# EAGLE design micromouse (EAGLE 9.6.2)
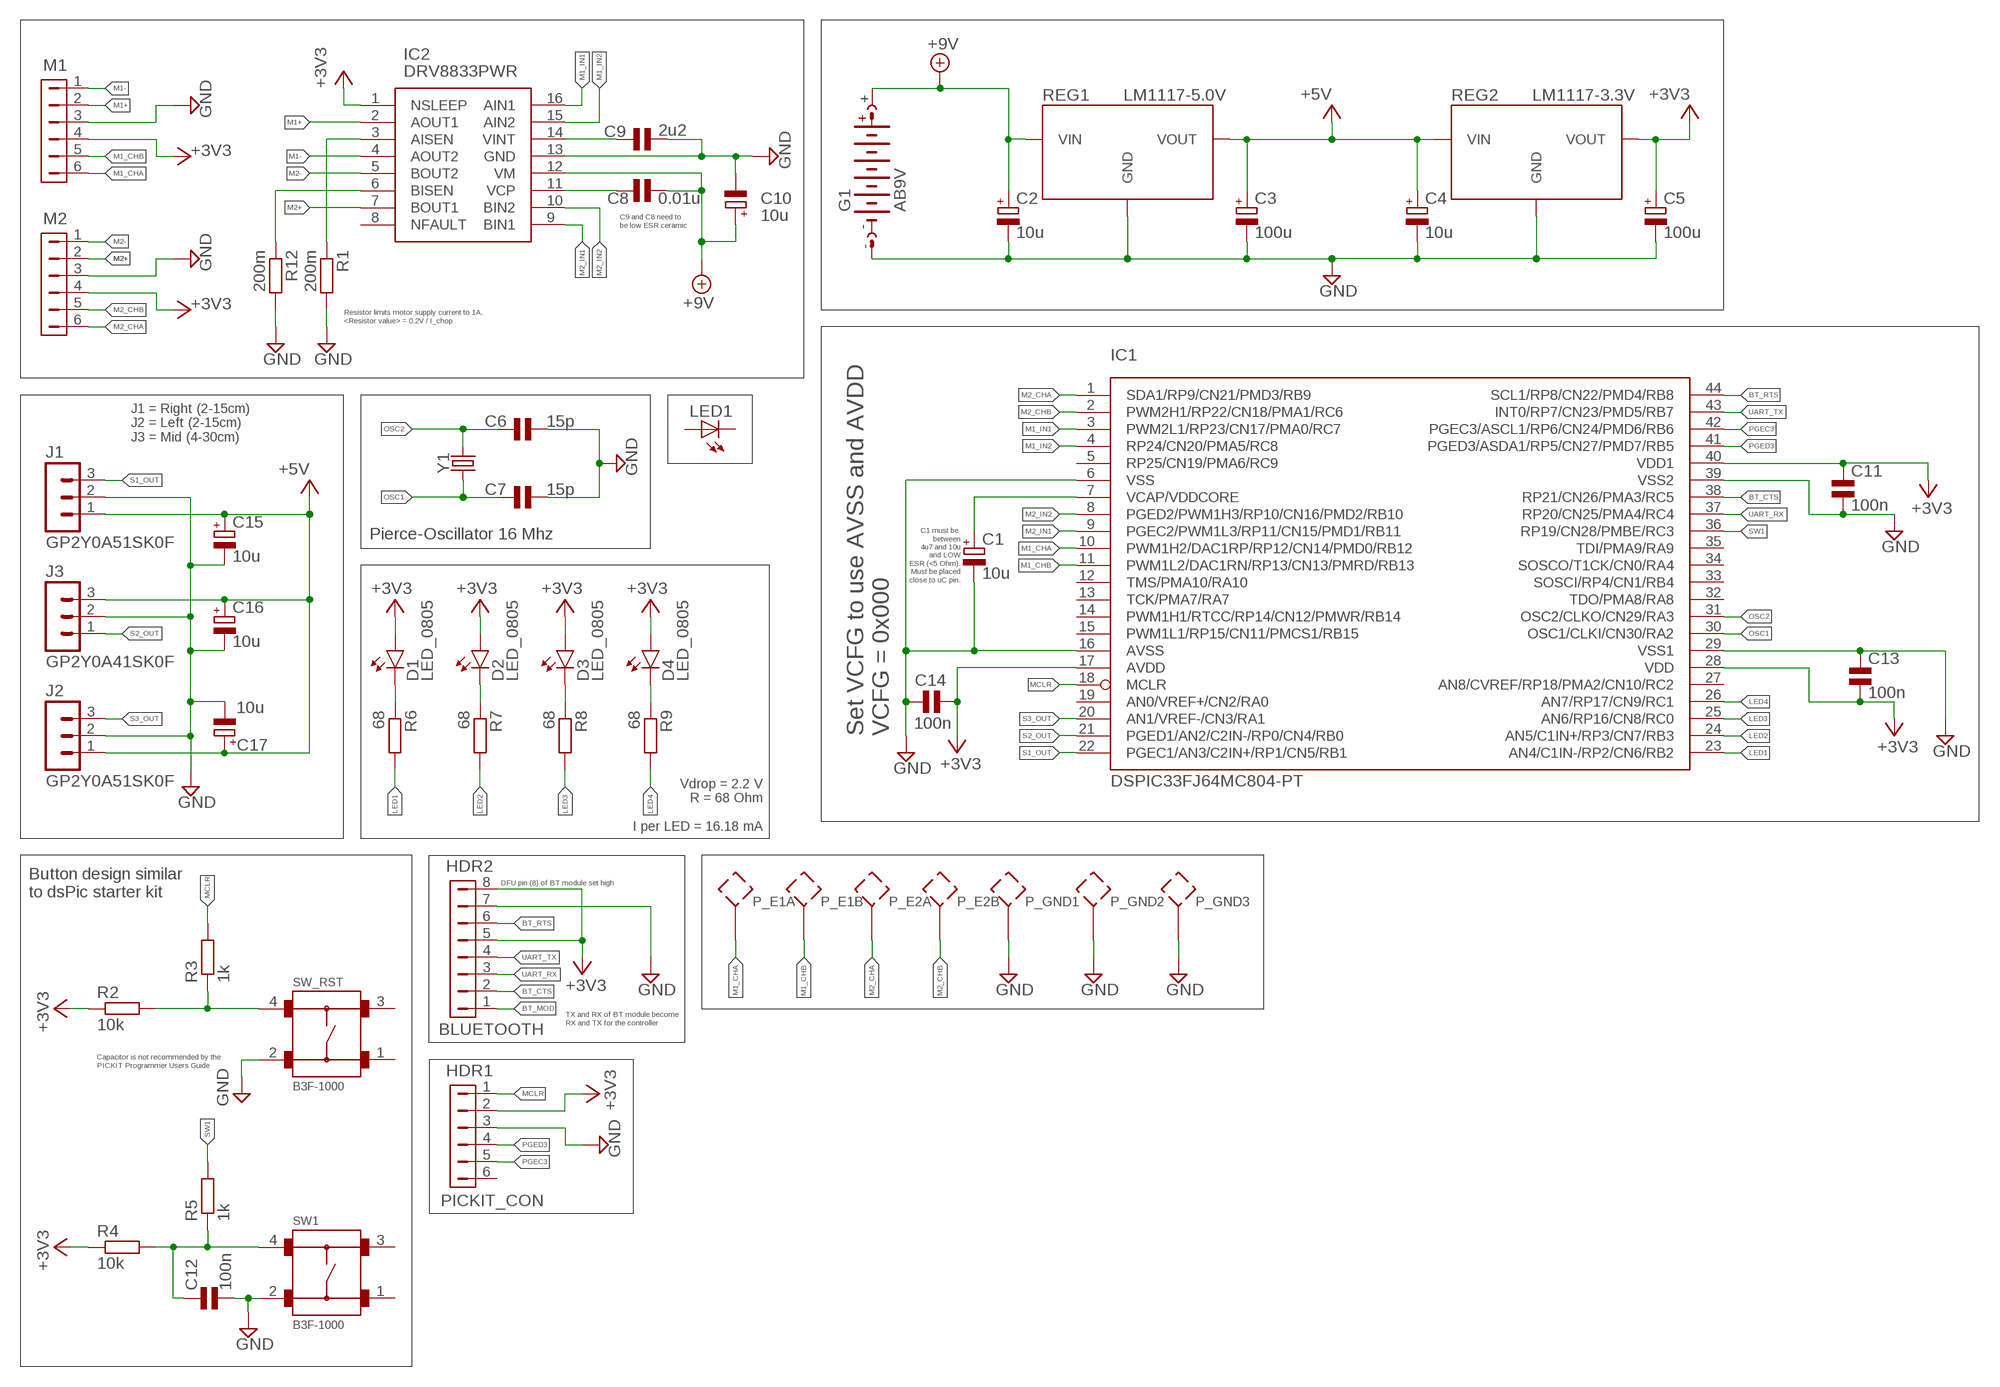
[diagram p0: schematic, sheet 1]

## Parts
C1  10u  CPOL_0805  [0805_POL]
C2  10u  CPOL_0805  [0805_POL]
C3  100u  CPOL_0805  [0805_POL]
C4  10u  CPOL_0805  [0805_POL]
C5  100u  CPOL_0805  [0805_POL]
C6  15p  C_0805  [0805]
C7  15p  C_0805  [0805]
C8  0.01u  C_0805  [0805]
C9  2u2  C_0805  [0805]
C10  10u  CPOL_0805  [0805_POL]
C11  100n  C_0805  [0805]
C12  100n  C_0805  [0805]
C13  100n  C_0805  [0805]
C14  100n  C_0805  [0805]
C15  10u  CPOL_0805  [0805_POL]
C16  10u  CPOL_0805  [0805_POL]
C17  10u  CPOL_0805  [0805_POL]
D1  LED_0805  [SMD_LED_0805]
D2  LED_0805  [SMD_LED_0805]
D3  LED_0805  [SMD_LED_0805]
D4  LED_0805  [SMD_LED_0805]
G1  AB9V  [AB9V]
HDR1  PICKIT_CON  [6PIN]
HDR2  BLUETOOTH  BLUETOOTHSHIELD  [1X08]
IC1  DSPIC33FJ64MC804-PT  [TQFP44]
IC2  DRV8833PWR  [SOP65P640X120-16N]
J1  GP2Y0A51SK0F  B3B-ZR  [B3B-ZR(LF)(SN)]
J2  GP2Y0A51SK0F  B3B-ZR  [B3B-ZR(LF)(SN)]
J3  GP2Y0A41SK0F  B3B-PH-K-S  [B3B-PH-K-S]
LED1  LED5MM  [LED5MM]
M1  MOTOR_CON  [JP3Q]
M2  MOTOR_CON  [JP3Q]
P_E1A  PROBE_POINTTHT  [PROBEPOINT_THT]
P_E1B  PROBE_POINTTHT  [PROBEPOINT_THT]
P_E2A  PROBE_POINTTHT  [PROBEPOINT_THT]
P_E2B  PROBE_POINTTHT  [PROBEPOINT_THT]
P_GND1  PROBE_POINTTHT  [PROBEPOINT_THT]
P_GND2  PROBE_POINTTHT  [PROBEPOINT_THT]
P_GND3  PROBE_POINTTHT  [PROBEPOINT_THT]
R1  200m  R_0805  [0805]
R2  10k  R_0805  [0805]
R3  1k  R_0805  [0805]
R4  10k  R_0805  [0805]
R5  1k  R_0805  [0805]
R6  68  R_0805  [0805]
R7  68  R_0805  [0805]
R8  68  R_0805  [0805]
R9  68  R_0805  [0805]
R12  200m  R_0805  [0805]
REG1  LM1117-5.0V  LM1117_SOT223  [SOT-223-4]
REG2  LM1117-3.3V  LM1117_SOT223  [SOT-223-4]
SW1  B3F-1000  [B3F-1000]
SW_RST  B3F-1000  [B3F-1000]
Y1  CRYSTALPTH-HC49US  [HC49US]

## Nets
+3V3: C5.1(+) C11.1(+) C13.2(-) C14.2(-) D1.P$2(A) D2.P$2(A) D3.P$2(A) D4.P$2(A) HDR1.2 HDR2.5 HDR2.8 IC1.17(AVDD) IC1.28(VDD) IC1.40(VDD1) IC2.1(NSLEEP) M1.4 M2.4 R2.1 R4.1 REG2.2(VOUT) REG2.4(VOUT)
+5V: C3.1(+) C4.1(+) C15.1(+) C16.1(+) C17.1(+) J1.1 J2.1 J3.3 REG1.2(VOUT) REG1.4(VOUT) REG2.3(VIN)
+9V: C2.1(+) C8.1(+) C10.1(+) G1.+ IC2.12(VM) REG1.3(VIN)
BT_CTS: HDR2.2 IC1.38(RP21/CN26/PMA3/RC5)
BT_MOD: HDR2.1
BT_RTS: HDR2.6 IC1.44(SCL1/RP8/CN22/PMD4/RB8)
GND: C1.2(-) C2.2(-) C3.2(-) C4.2(-) C5.2(-) C6.2(-) C7.2(-) C9.2(-) C10.2(-) C11.2(-) C12.2(-) C13.1(+) C14.1(+) C15.2(-) C16.2(-) C17.2(-) G1.- HDR1.3 HDR2.7 IC1.6(VSS) IC1.16(AVSS) IC1.29(VSS1) IC1.39(VSS2) IC2.13(GND) J1.2 J2.2 J3.2 M1.3 M2.3 P_GND1.P$1 P_GND2.P$1 P_GND3.P$1 R1.2 R12.2 REG1.1(GND) REG2.1(GND) SW1.2 SW_RST.2
LED1: IC1.23(AN4/C1IN-/RP2/CN6/RB2) R6.2
LED2: IC1.24(AN5/C1IN+/RP3/CN7/RB3) R7.2
LED3: IC1.25(AN6/RP16/CN8/RC0) R8.2
LED4: IC1.26(AN7/RP17/CN9/RC1) R9.2
M1+: IC2.2(AOUT1) M1.2
M1-: IC2.4(AOUT2) M1.1
M1_CHA: IC1.10(PWM1H2/DAC1RP/RP12/CN14/PMD0/RB12) M1.6 P_E1A.P$1
M1_CHB: IC1.11(PWM1L2/DAC1RN/RP13/CN13/PMRD/RB13) M1.5 P_E1B.P$1
M1_IN1: IC1.3(PWM2L1/RP23/CN17/PMA0/RC7) IC2.16(AIN1)
M1_IN2: IC1.4(RP24/CN20/PMA5/RC8) IC2.15(AIN2)
M2+: IC2.7(BOUT1) M2.2
M2-: IC2.5(BOUT2) M2.1
M2_CHA: IC1.1(SDA1/RP9/CN21/PMD3/RB9) M2.6 P_E2A.P$1
M2_CHB: IC1.2(PWM2H1/RP22/CN18/PMA1/RC6) M2.5 P_E2B.P$1
M2_IN1: IC1.9(PGEC2/PWM1L3/RP11/CN15/PMD1/RB11) IC2.9(BIN1)
M2_IN2: IC1.8(PGED2/PWM1H3/RP10/CN16/PMD2/RB10) IC2.10(BIN2)
MCLR: HDR1.1 IC1.18(MCLR) R3.2
N$1: IC2.6(BISEN) R12.1
N$2: D2.P$1(C) R7.1
N$3: C8.2(-) IC2.11(VCP)
N$4: C9.1(+) IC2.14(VINT)
N$5: IC2.3(AISEN) R1.1
N$6: C12.1(+) R4.2 R5.1 SW1.4
N$7: R2.2 R3.1 SW_RST.4
N$9: D1.P$1(C) R6.1
N$13: D3.P$1(C) R8.1
N$15: D4.P$1(C) R9.1
OSC1: C7.1(+) IC1.30(OSC1/CLKI/CN30/RA2) Y1.1
OSC2: C6.1(+) IC1.31(OSC2/CLKO/CN29/RA3) Y1.2
PGEC3: HDR1.5 IC1.42(PGEC3/ASCL1/RP6/CN24/PMD6/RB6)
PGED3: HDR1.4 IC1.41(PGED3/ASDA1/RP5/CN27/PMD7/RB5)
S1_OUT: IC1.22(PGEC1/AN3/C2IN+/RP1/CN5/RB1) J1.3
S2_OUT: IC1.21(PGED1/AN2/C2IN-/RP0/CN4/RB0) J3.1
S3_OUT: IC1.20(AN1/VREF-/CN3/RA1) J2.3
SW1: IC1.36(RP19/CN28/PMBE/RC3) R5.2
UART_RX: HDR2.3 IC1.37(RP20/CN25/PMA4/RC4)
UART_TX: HDR2.4 IC1.43(INT0/RP7/CN23/PMD5/RB7)
VCAP/VDDCORE: C1.1(+) IC1.7(VCAP/VDDCORE)
Unconnected: HDR1.6 IC1.5(RP25/CN19/PMA6/RC9) IC1.12(TMS/PMA10/RA10) IC1.13(TCK/PMA7/RA7) IC1.14(PWM1H1/RTCC/RP14/CN12/PMWR/RB14) IC1.15(PWM1L1/RP15/CN11/PMCS1/RB15) IC1.19(AN0/VREF+/CN2/RA0) IC1.27(AN8/CVREF/RP18/PMA2/CN10/RC2) IC1.32(TDO/PMA8/RA8) IC1.33(SOSCI/RP4/CN1/RB4) IC1.34(SOSCO/T1CK/CN0/RA4) IC1.35(TDI/PMA9/RA9) IC2.8(NFAULT) LED1.A LED1.K(C) SW1.1 SW1.3 SW_RST.1 SW_RST.3

## Notes on the sheet
- C9 and C8 need to
  be low ESR ceramic
- Resistor limits motor supply current to 1A.
  <Resistor value> = 0.2V / I_chop
- J1 = Right (2-15cm)
  J2 = Left (2-15cm)
  J3 = Mid (4-30cm)
- Pierce-Oscillator 16 Mhz
- C1 must be 
  between
  4u7 and 10u
  and LOW
  ESR (<5 Ohm).
  Must be placed
  close to uC pin.
- Set VCFG to use AVSS and AVDD
  VCFG = 0x000
- Vdrop = 2.2 V
  R = 68 Ohm
  
  I per LED = 16.18 mA
- DFU pin (8) of BT module set high
- Button design similar
  to dsPic starter kit
- TX and RX of BT module become
  RX and TX for the controller
- Capacitor is not recommended by the
  PICKIT Programmer Users Guide

## Library data of the parts
C1-C5 C10 C15-C17 = micromouse:CPOL_0805
C6-C9 C11-C14 = micromouse:C_0805
D1-D4 = micromouse:LED_0805
G1 = micromouse:AB9V: 9-V BATTERY CLIP
HDR1 = micromouse:PICKIT_CON
HDR2 = micromouse:BLUETOOTHSHIELD
IC1 = microchip-dspic33fjxxmc:DSPIC33FJ64MC804: dsPIC33FJ32MC302/304, dsPIC33FJ64MCX02/X04, AND dsPIC33FJ128MCX02/X04 High-Performance, 16-bit Digital Signal Controllers Package:44 Pin TQFP Operating Range: * Up to 40 MIPS operation (at 3.0V -3.6V): - Industrial temperature range (-40°C to +85°C) - Extended temperature range (-40°C to +125°C) High-Performance DSC CPU: * Modified Harvard architecture * C compiler optimized instruction set * 16-bit wide data path * 24-bit wide instructions * Linear program memory addressing up to 4M instruction words * Linear data memory addressing up to 64 Kbytes * 83 base instructions: mostly 1 word/1 cycle * Two 40-bit accumulators with rounding and saturation options * Flexible and powerful addressing modes: - Indirect - Modulo - Bit-Reversed * Software stack * 16 x 16 fractional/integer multiply operations * 32/16 and 16/16 divide operations * Single-cycle multiply and accumulate: - Accumulator write back for DSP operations - Dual data fetch * Up to ±16-bit shifts for up to 40-bit data Direct Memory Access (DMA): * 8-channel hardware DMA * Up to 2 Kbytes dual ported DMA buffer area (DMA RAM) to store data transferred via DMA: - Allows data transfer between RAM and a peripheral while CPU is executing code (no cycle stealing) * Most peripherals support DMA Timers/Capture/Compare/PWM: * Timer/Counters, up to five 16-bit timers: - Can pair up to make two 32-bit timers - One timer runs as a Real-Time Clock with an external 32.768 kHz oscillator - Programmable prescaler * Input Capture (up to four channels): - Capture on up, down or both edges - 16-bit capture input functions - 4-deep FIFO on each capture * Output Compare (up to four channels): - Single or Dual 16-bit Compare mode - 16-bit Glitchless PWM mode * Hardware Real-Time Clock/Calendar (RTCC): - Provides clock, calendar, and alarm functions Interrupt Controller: * 5-cycle latency * Up to 53 available interrupt sources * Up to three external interrupts * Seven programmable priority levels * Five processor exceptions Digital I/O: * Peripheral pin Select functionality * Up to 35 programmable digital I/O pins * Wake-up/Interrupt-on-Change for up to 31 pins * Output pins can drive from 3.0V to 3.6V * Up to 5V output with open drain configuration * All digital input pins are 5V tolerant * 4 mA sink on all I/O pins On-Chip Flash and SRAM: * Flash program memory (up to 128 Kbytes) * Data SRAM (up to 16 Kbytes) * Boot, Secure, and General Security for program Flash System Management: * Flexible clock options: - External, crystal, resonator, internal RC - Fully integrated Phase-Locked Loop (PLL) - Extremely low jitter PLL * Power-up Timer * Oscillator Start-up Timer/Stabilizer * Watchdog Timer with its own RC oscillator * Fail-Safe Clock Monitor * Reset by multiple sources Power Management: * On-chip 2.5V voltage regulator * Switch between clock sources in real time * Idle, Sleep, and Doze modes with fast wake-up Analog-to-Digital Converters (ADCs): * 10-bit, 1.1 Msps or 12-bit, 500 Ksps conversion: - Two and four simultaneous samples (10-bit ADC) - Up to nine input channels with auto-scanning - Conversion start can be manual or synchronized with one of four trigger sources - Conversion possible in Sleep mode - ±2 LSb max integral nonlinearity - ±1 LSb max differential nonlinearity Audio Digital-to-Analog Converter (DAC): - 16-bit Dual Channel DAC module - 100 Ksps maximum sampling rate - Second-Order Digital Delta-Sigma Modulator Comparator Module: * Two analog comparators with programmable input/output configuration CMOS Flash Technology: * Low-power, high-speed Flash technology * Fully static design * 3.3V (±10%) operating voltage * Industrial and Extended temperature * Low power consumption Motor Control Peripherals: * 6-channel 16-bit Motor Control PWM: - Three duty cycle generators - Independent or Complementary mode - Programmable dead-time and output polarity - Edge-aligned or center-aligned - Manual output override control - One Fault input - Trigger for ADC conversions - PWM frequency for 16-bit resolution (@ 40 MIPS) = 1220 Hz for Edge-Aligned mode, 610 Hz for Center-Aligned mode - PWM frequency for 11-bit resolution (@ 40 MIPS) = 39.1 kHz for Edge-Aligned mode, 19.55 kHz for Center-Aligned mode * 2-channel 16-bit Motor Control PWM: - One duty cycle generator - Independent or Complementary mode - Programmable dead time and output polarity - Edge-aligned or center-aligned - Manual output override control - One Fault input - Trigger for ADC conversions - PWM frequency for 16-bit resolution (@ 40 MIPS) = 1220 Hz for Edge-Aligned mode, 610 Hz for Center-Aligned mode - PWM frequency for 11-bit resolution (@ 40 MIPS) = 39.1 kHz for Edge-Aligned mode, 19.55 kHz for Center-Aligned mode * 2-Quadrature Encoder Interface module: - Phase A, Phase B, and index pulse input - 16-bit up/down position counter - Count direction status - Position Measurement (x2 and x4) mode - Programmable digital noise filters on inputs - Alternate 16-bit Timer/Counter mode - Interrupt on position counter rollover/underflow
IC2 = SamacSys_Parts:DRV8833PWR: 2A Low Voltage Dual Brushed DC or Single Bipolar Stepper Motor Driver (PWM Ctrl) Source: Datasheet <http://www.ti.com/lit/gpn/drv8833>; DESCRIPTION: 2A Low Voltage Dual Brushed DC or Single Bipolar Stepper Motor Driver (PWM Ctrl); HEIGHT: 1.2mm; MANUFACTURER_NAME: Texas Instruments; MANUFACTURER_PART_NUMBER: DRV8833PWR; MOUSER_PART_NUMBER: 595-DRV8833PWR; MOUSER_PRICE-STOCK: https://www.mouser.co.uk/ProductDetail/Texas-Instruments/DRV8833PWR?qs=biyDIajrTn6zZVfCUiXZ9g%3D%3D
J1 J2 = micromouse:B3B-ZR
J3 = micromouse:B3B-PH: JST PH series header 2.00mm pitch disconnectable crimp style connectors, vertical (side entry type), 3 pins
LED1 = adafruit:LED: LED OSRAM: - CHIPLED LG R971, LG N971, LY N971, LG Q971, LY Q971, LO R971, LY R971 LH N974, LH R974 LS Q976, LO Q976, LY Q976 LO Q996 - Hyper CHIPLED LW Q18S LB Q993, LB Q99A, LB R99A - SideLED LS A670, LO A670, LY A670, LG A670, LP A670 LB A673, LV A673, LT A673, LW A673 LH A674 LY A675 LS A676, LA A676, LO A676, LY A676, LW A676 LS A679, LY A679, LG A679 - Hyper Micro SIDELED® LS Y876, LA Y876, LO Y876, LY Y876 LT Y87S - SmartLED LW L88C, LW L88S LB L89C, LB L89S, LG L890 LS L89K, LO L89K, LY L89K LS L896, LA L896, LO L896, LY L896 - TOPLED LS T670, LO T670, LY T670, LG T670, LP T670 LSG T670, LSP T670, LSY T670, LOP T670, LYG T670 LG T671, LOG T671, LSG T671 LB T673, LV T673, LT T673, LW T673 LH T674 LS T676, LA T676, LO T676, LY T676, LB T676, LH T676, LSB T676, LW T676 LB T67C, LV T67C, LT T67C, LS T67K, LO T67K, LY T67K, LW E67C LS E67B, LA E67B, LO E67B, LY E67B, LB E67C, LV E67C, LT E67C LW T67C LS T679, LY T679, LG T679 LS T770, LO T770, LY T770, LG T770, LP T770 LB T773, LV T773, LT T773, LW T773 LH T774 LS E675, LA E675, LY E675, LS T675 LS T776, LA T776, LO T776, LY T776, LB T776 LHGB T686 LT T68C, LB T68C - Hyper Mini TOPLED® LB M676 - Mini TOPLED Santana® LG M470 LS M47K, LO M47K, LY M47K Source: http://www.osram.convergy.de/
M1 M2 = micromouse:MOTOR_CON
P_E1A P_E1B P_E2A P_E2B P_GND1-P_GND3 = micromouse:PROBE_POINT
R1-R9 R12 = micromouse:R_0805
REG1 REG2 = micromouse:LM1117_SOT223
SW1 SW_RST = micromouse:B3F-1000: Tactile Switch SPST-NO Top Actuated Through Hole Manufacturer's datasheet <https://omronfs.omron.com/en_US/ecb/products/pdf/en-b3f.pdf>; CREATED_BY: PCBLayout.com; DIGI_KEY_PART_NUMBER: SW400-ND; MANUFACTURER: Omron Electronics Inc-EMC Div; MPN: B3F-1000; PACKAGE: SPST-NO
Y1 = SparkFun-Clocks:CRYSTAL: Crystals (Generic) These are passive quartz crystals, which can be used as a clock source for a microcontroller. Crystal's are two-terminal devices. They require external "load" capacitors to generate an oscillating signal.

## Net classes
0 default: drill 0.3 mm, clearance 0.2 mm

## Board
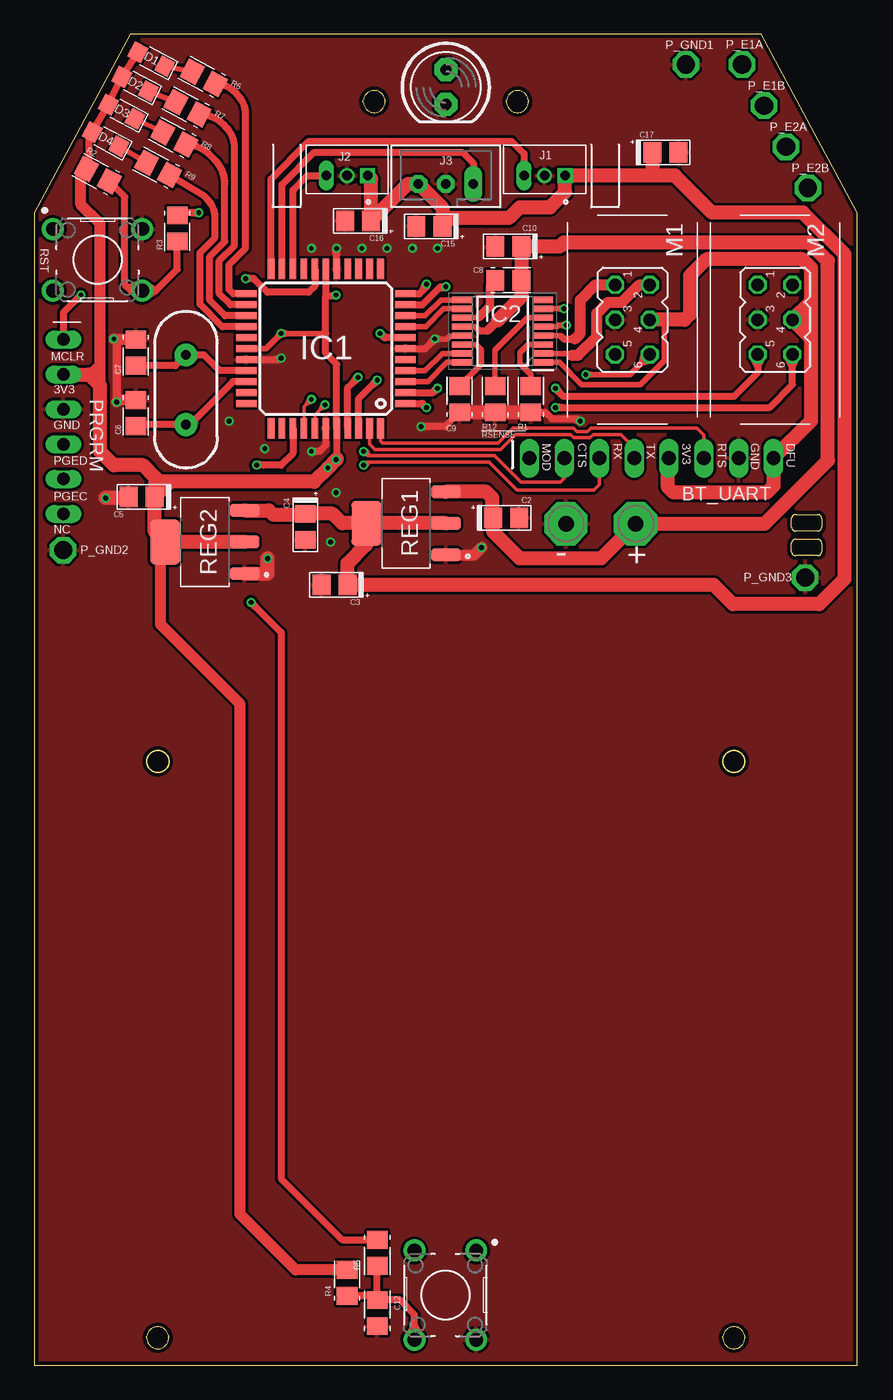
[diagram p1: board, top side]
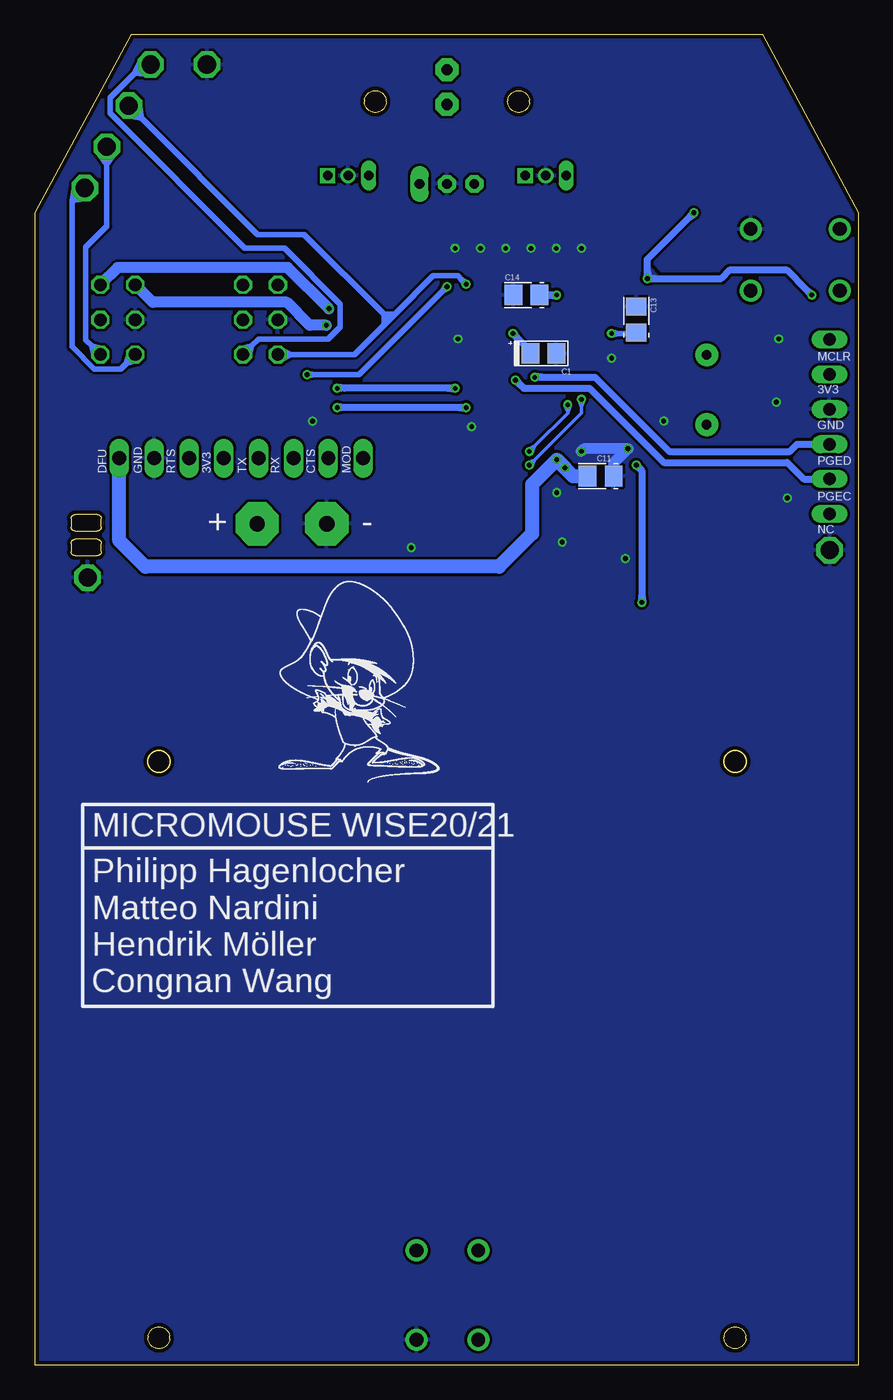
[diagram p2: board, bottom side, seen from below]

Size 60 x 97 mm. Coordinates in mm from the lower left corner, seen from the top.
Outline: 25.57,92.21 arc165 23.98,92.2 23.98,92.14 23.98,92.06 arc180 25.58,92.14 25.57,92.21
Outline: 25.57,92.21 25.57,92.21
Outline: 57.1,60.8 arc90 57.4,61.1 57.4,61.7 arc90 57.1,62 55.5,62 arc90 55.2,61.7 55.2,61.1 arc90 55.5,60.8 57.1,60.8
Outline: 55.2,59.3 arc90 55.5,59 57.1,59 arc90 57.4,59.3 57.4,59.9 arc90 57.1,60.2 55.5,60.2 arc90 55.2,59.9 55.2,59.3
Outline: 50.2,1.96 arc180 51.8,2.04 51.79,2.11 arc165 50.2,2.1 50.2,2.04 50.2,1.96
Outline: 34.42,92.14 34.43,92.2 arc-165 36.02,92.21 36.02,92.14 arc-180 34.42,92.06 34.42,92.14
Outline: 9.79,2.11 arc165 8.2,2.1 8.2,2.04 8.2,1.96 arc180 9.8,2.04 9.79,2.11
Outline: 7,97 0,84 0,0 60,0 60,84 53,97 7,97
Outline: circle at 51,44 radius 0.8
Outline: circle at 9,44 radius 0.8
Copper layers (1*16): Top 0.035mm / dielectric 1.5mm / Bottom 0.035mm
Design rules "PCB-POOL Standard": minimum track width 0.15mm, minimum drill 0.3mm, track to track 0.15mm, track to pad 0.15mm, pad to pad 0.15mm, via to via 0.15mm, smd to smd 0.15mm, copper to edge 0.3mm, drill to drill 0.2mm, minimum pad ring 0.2mm, minimum via ring 0.15mm, stop-mask expansion 0.03mm, vias tented up to drill 0mil, thermal gap 0.2mm

### Footprints (pad centres in the part's own frame; a part is rotated, then mirrored left to right if it is on the bottom)
0805_POL = smd 1.3 x 1.5: 1 -0.95,0; 2 0.95,0
0805 = smd 1.3 x 1.5: 1 -0.95,0; 2 0.95,0
SMD_LED_0805 = smd 1.1 x 1.25: P$1 -1.1,0; P$2 1.1,0
AB9V = drill 1.118 pad 3.15 octagon: + 0,2.54; - 0,-2.54
6PIN = drill 0.914 long: 1 -2.54,0; 2 0,0; 3 2.54,0; 4 5.08,0; 5 7.62,0; 6 10.16,0
1X08 = drill 1.016 long: 1 -8.89,0; 2 -6.35,0; 3 -3.81,0; 4 -1.27,0; 5 1.27,0; 6 3.81,0; 7 6.35,0; 8 8.89,0
TQFP44 = smd 1.5 x 0.5: 1 -5.8,4; 2 -5.8,3.2; 3 -5.8,2.4; 4 -5.8,1.6; 5 -5.8,0.8; 6 -5.8,0; 7 -5.8,-0.8; 8 -5.8,-1.6; 9 -5.8,-2.4; 10 -5.8,-3.2; 11 -5.8,-4; 23 5.8,-4; 24 5.8,-3.2; 25 5.8,-2.4; 26 5.8,-1.6; 27 5.8,-0.8; 28 5.8,0; 29 5.8,0.8; 30 5.8,1.6; 31 5.8,2.4; 32 5.8,3.2; 33 5.8,4 | smd 0.5 x 1.5: 12 -4,-5.8; 13 -3.2,-5.8; 14 -2.4,-5.8; 15 -1.6,-5.8; 16 -0.8,-5.8; 17 0,-5.8; 18 0.8,-5.8; 19 1.6,-5.8; 20 2.4,-5.8; 21 3.2,-5.8; 22 4,-5.8; 34 4,5.8; 35 3.2,5.8; 36 2.4,5.8; 37 1.6,5.8; 38 0.8,5.8; 39 0,5.8; 40 -0.8,5.8; 41 -1.6,5.8; 42 -2.4,5.8; 43 -3.2,5.8; 44 -4,5.8
SOP65P640X120-16N = smd 1.475 x 0.45: 1 -2.938,2.275; 2 -2.938,1.625; 3 -2.938,0.975; 4 -2.938,0.325; 5 -2.938,-0.325; 6 -2.938,-0.975; 7 -2.938,-1.625; 8 -2.938,-2.275; 9 2.938,-2.275; 10 2.938,-1.625; 11 2.938,-0.975; 12 2.938,-0.325; 13 2.938,0.325; 14 2.938,0.975; 15 2.938,1.625; 16 2.938,2.275
B3B-ZR(LF)(SN) = drill 0.7 square: 1 1.5,0 | drill 0.7: 2 0,0 | drill 0.7 long: 3 -1.5,0
B3B-PH-K-S = drill 0.7 pad 1.3 long: 1 2,0 | drill 0.7 pad 1.3 octagon: 2 0,0; 3 -2,0
LED5MM = drill 0.813 pad 1.676 octagon: A -1.27,0; K 1.27,0
JP3Q = drill 0.914 octagon: 1 -2.54,-1.27; 2 -2.54,1.27; 3 0,-1.27; 4 0,1.27; 5 2.54,-1.27; 6 2.54,1.27
PROBEPOINT_THT = drill 1.32 pad 1.93 octagon: P$1 0,0
SOT-223-4 = smd 0.95 x 2.15: 1 -2.3,-2.9; 2 0,-2.9; 3 2.3,-2.9 | smd 3.25 x 2.15: 4 0,2.9
B3F-1000 = drill 1 pad 1.6: 1 -3.25,2.25; 2 3.25,2.25; 3 -3.25,-2.25; 4 3.25,-2.25
HC49US = drill 0.7 pad 1.651: 1 -2.54,0; 2 2.54,0

### Placement (x,y rotation side)
C1  22.97,73.74 0 bottom
C2  34.39,61.76 0 top
C3  21.88,56.88 180 top
C4  19.75,61.11 270 top
C5  7.84,63.28 180 top
C6  7.4,69.4 90 top
C7  7.4,73.8 90 top
C8  34.55,79.07 180 top
C9  31,70.4 270 top
C10  34.55,81.53 180 top
C11  18.8,64.8 0 bottom
C12  25,3.8 270 top
C13  16.2,76.2 270 bottom
C14  24.2,78 0 bottom
C15  28.8,83 180 top
C16  23.6,83.4 180 top
C17  46,88.4 0 top
D1  8.53,95.18 152 top
D2  7.35,93.37 152 top
D3  6.38,91.36 152 top
D4  5.2,89.35 152 top
G1  41.3,61.33 270 top
HDR1  2.11,72.21 270 top
HDR2  45,66.1 0 top
IC1  21.25,74.09 180 top
IC2  34.14,75.37 180 top
J1  37.2,86.7 0 top
J2  22.8,86.7 0 top
J3  30,86.1 0 top
LED1  30,93.16 270 top
M1  43.6,76.2 270 top
M2  54,76.2 270 top
P_E1A  51.6,94.8 0 top
P_E1B  53.2,91.8 0 top
P_E2A  54.8,88.8 0 top
P_E2B  56.4,85.8 0 top
P_GND1  47.5,94.8 0 top
P_GND2  2.1,59.4 90 top
P_GND3  56.2,57.4 0 top
R1  36.2,70.4 270 top
R2  4.63,86.73 332 top
R3  10.42,82.85 90 top
R4  22.8,6 270 top
R5  25,8.2 90 top
R6  820  [0805]  12.35,93.83 332 top
R7  820  [0805]  11.18,91.61 332 top
R8  820  [0805]  10.2,89.4 332 top
R9  820  [0805]  9.02,87.19 332 top
R12  33.6,70.4 270 top
REG1  27.1,61.36 90 top
REG2  12.43,60 90 top
SW1  29.96,5.11 270 top
SW_RST  4.61,80.56 0 top
Y1  11.06,71.09 270 top

### Tracks (layer width: path | path; a pad name or v marks a point on that pad's centre or on a via)
+3V3  (via drill 0.35)
  Top 0.406: 46,76.2 45.93,76.13 45.93,73.22 44.18,71.47 39.9,71.47 38.28,73.09 IC2.1 | IC1.28 16.89,74.09 17.63,74.83 | 17.63,74.83 v18,75.2 | v18,75.2 18.52,75.2 | 18.52,75.2 21.25,75.2 | 17.63,74.83 18.06,75.1 v18,75.2 | 17.63,74.83 17.9,75.26 v18,75.2 | 18.52,75.2 18.03,75.32 v18,75.2 | 18.52,75.2 18.03,75.08 v18,75.2
  Top 0.508: 22.05,66.52 IC1.40 22.05,72.95 21.25,73.75 21.25,75.2 21.25,77.95 | 22.05,66.52 22.05,66.05 | IC1.17 21.25,77.95 | R2.1 4,87.39 4,89.64 D4.P$2 D3.P$2 D2.P$2 D1.P$2 | 22.05,66.52 21.93,66.02 v22,66 22.07,66 22.05,66.52 | 21.25,77.95 21.95,77.95 v22,78
  Top 0.61: 3.99,72.21 4.01,72.21 4.8,73
  Top 0.813: 4.8,71.4 4.8,73 4.8,83.2 3.4,84.6 3.4,86.79 R2.1 | R4.1 19.05,6.95 15,11 15,48.2 9.2,54 9.2,59.66 REG2.4
  Top 1.016: REG2.2 REG2.4 8.79,60.75 C5.1 | C5.1 9.91,64.4 | C5.1 8.82,63.32 8.82,64.7 | 8.82,64.7 7.93,65.6 5.8,65.6 4.8,66.6 4.8,71.4 3.99,72.21 HDR1.2 | M1.4 46,76.2 47.4,76.2 47.8,76.6 47.8,79.4 49,80.6 56,80.6 56.64,79.97 56.64,77.56 | 22.05,66.05 v22,66 v21.4,65.4 20.4,64.4 9.91,64.4 | M2.4 56,76.2 56.64,75.56 | 56.64,74.84 56.64,68.84 HDR2.8 53.89,64.09 53.4,63.6 46.6,63.6 46.2,64 46.2,66.03 HDR2.5 | 56.64,74.84 56.64,75.56 | 56.64,75.56 56.64,77.56 | 9.91,64.4 9.13,64.4 8.82,64.7 | M2.4 56.64,77.56 | M2.4 56.64,74.84
  Bottom 0.406: v18,75.2 17.48,75.2 | 17.48,75.2 16.25,75.2 C13.2 | 17.48,75.2 17.97,75.08 v18,75.2 | 17.48,75.2 17.97,75.32 v18,75.2
  Bottom 0.508: v22,78 22.52,78 | 22.52,78 C14.2 | 22.52,78 22.01,78.07 v22,78 | 22.52,78 22.01,77.93 v22,78
  Bottom 1.016: v21.4,65.4 v22,66 | v22,66 20.8,64.8 C11.1 | v22,66 23.8,64.2 23.8,60.6 26.2,58.2 52,58.2 53.89,60.09 HDR2.8
+5V
  Top 1.016: REG1.2 REG1.4 | REG2.3 17.1,62.3 17.4,62 19.69,62 C4.1 21.74,62.06 22.44,61.36 REG1.4 | C17.1 45.05,86.75 45,86.7 | REG1.4 24.2,59.8 22.83,58.43 C3.1 49.52,56.88 50.92,55.48 57.22,55.48 59.07,57.33 59.07,80.97 56.04,84 49.4,84 46.7,86.7 45,86.7 | 45,86.7 J1.1 38.7,85.5 37.6,84.4 35.4,84.4 34.6,83.6 30.35,83.6 C15.1 29.75,84.35 J3.3 27.25,86.1 C16.1 24.55,86.45 J2.1
+9V
  Top 0.406: IC2.12 32.16,75.69 32.25,75.6
  Top 0.508: 32.25,75.6 32.46,75.39 33.02,75.39
  Top 0.61: 33.02,75.39 33.79,76.16
  Top 1.016: REG1.3 32.94,63.66 33.4,63.2 33.4,61.8 C2.1 33.45,60.75 35.4,58.8 41.32,58.8 G1.+ 53.25,61.33 57.85,65.93 57.85,80.47 56.5,81.82 38.59,81.82 38.3,81.53 C10.1 C8.1 35.51,77.87 33.79,76.16
BT_CTS  (via drill 0.35)
  Top 0.254: IC1.38 20.45,69.25 20.83,69.63 | 20.83,69.63 v21.2,70 | v24,66.6 24.31,66.29 24.43,66.29 | HDR2.2 38.65,64.65 38.36,64.36 35.48,64.36 33.55,66.29 24.43,66.29 | 20.83,69.63 21.28,69.82 v21.2,70 | 20.83,69.63 21.02,70.08 v21.2,70 | 24.43,66.29 24.17,66.7 v24,66.6 | 24.43,66.29 23.95,66.41 v24,66.6
  Bottom 0.254: v24,66.6 23.63,66.97 | 23.63,66.97 21.2,69.4 21.2,69.47 | 21.2,69.47 v21.2,70 | 21.2,69.47 21.38,69.92 v21.2,70 | 21.2,69.47 21.02,69.92 v21.2,70 | 23.63,66.97 23.82,66.52 v24,66.6 | 23.63,66.97 24.08,66.78 v24,66.6
BT_RTS
  Top 0.254: IC1.44 25.25,67.35 25.4,67.2 33.8,67.2 34.89,68.3 39.3,68.3 39.55,68.05 40.33,68.05 40.57,68.3 48.3,68.3 48.81,67.79 HDR2.6
GND  (via drill 0.35)
  Top 0.406: IC2.13 31.18,75.02 30.3,75.02 30.08,74.8 29.73,74.8 | 29.73,74.8 v29.2,74.8 | 29.73,74.8 29.23,74.92 v29.2,74.8 | 29.73,74.8 29.23,74.68 v29.2,74.8
  Top 0.508: IC1.39 21.25,67.05 20.8,66.6 20.73,66.6 | 20.73,66.6 v20.2,66.6 | IC1.29 17.49,73.29 | 17.49,73.29 17.89,73.29 v18,73.4 | R1.2 37.25,69.45 37.72,68.98 39.31,68.98 | v39.8,68.8 39.62,68.98 39.31,68.98 | IC1.6 28.49,74.09 28.83,74.43 | 28.83,74.43 v29.2,74.8 | IC1.16 22.05,80.88 | 22.05,80.88 v22.05,81.39 v22.04,81.4 | C9.2 29.95,68.4 28.73,68.4 | 28.73,68.4 v28.2,68.4 | 17.49,73.29 18.01,73.33 v18,73.4 | 17.49,73.29 17.98,73.47 v18,73.4 | 20.73,66.6 20.21,66.67 v20.2,66.6 | 20.73,66.6 20.21,66.53 v20.2,66.6 | 39.31,68.98 39.77,68.74 v39.8,68.8 | 39.31,68.98 39.81,68.87 v39.8,68.8 | 28.73,68.4 28.21,68.47 v28.2,68.4 | 28.73,68.4 28.21,68.33 v28.2,68.4 | 28.83,74.43 29.24,74.74 v29.2,74.8 | 28.83,74.43 29.14,74.84 v29.2,74.8 | 22.05,80.88 22.11,81.39 v22.04,81.4 | 22.05,80.88 21.97,81.39 v22.04,81.4
  Top 0.61: v6,70.2 6,74.6
  Top 0.813: 5.81,74.8 5.86,74.75 C7.2 | C6.2 6.15,70.35 v6,70.2 | REG1.1 32.06,59.06 v32.6,59.6
  Top 1.016: C9.2 R12.2 R1.2 | REG2.1 17,57.7 v17,58.8 | C5.2 6.81,63.2 v5.2,63.2
  Bottom 0.813: v20.2,66.6 20,66.8 v16.8,66.8 17.85,65.75 C11.2
  other vias: 14.2,68.8 20.2,81.4 23.88,81.4 25.72,81.4 27.56,81.4 29.4,81.4 5.8,74.8 22,63.6 21.6,60
  pour Bottom (rank 5): -0.6,79.2 -0.6,97.8 60.8,97.8 60.8,-0.6 -0.8,-0.6 -0.8,77 -1,77
  pour Top (rank 5): -0.6,97.8 61,97.8 61,-0.6 -0.4,-0.6 -0.4,96
LED1
  Top 0.508: R6.2 13.22,93.38 arc-45 14.59,92.81 14.83,92.57 arc-45 15.4,91.2 15.4,81.4 14.2,80.2 14.2,78.4 14.51,78.09 IC1.23
LED2
  Top 0.508: IC1.24 14.31,77.29 13.49,78.11 13.49,80.49 14.6,81.6 14.6,88.76 arc45 14,90.2 13.75,90.45 arc45 R7.2
LED3
  Top 0.508: IC1.25 13.91,76.49 12.78,77.61 12.78,80.79 13.89,81.89 13.89,86.11 arc45 13.18,87.82 12.75,88.25 arc45 R8.2
LED4
  Top 0.508: IC1.26 13.71,75.69 12.08,77.32 12.08,81.08 13.18,82.18 13.18,83.6 arc45 12.6,85 12.4,85.2 R9.2
M1+
  Top 0.406: 39.2,73.6 39.06,73.74 IC2.2
  Top 0.813: M1.2 44.12,78.74 42.85,77.48 41.82,77.48 41,76.66 41,74.97 39.63,73.6 39.2,73.6
M1-
  Top 0.406: IC2.4 38.36,75.04 38.4,75
  Top 0.508: 38.4,75 38.6,74.8 39.4,74.8
  Top 0.813: 39.4,74.8 39.8,75.2 39.8,77.63 40.91,78.74 M1.1
M1_CHA  (via drill 0.35)
  Top 0.406: v40.2,72.2 40.73,72.2 | 40.73,72.2 43.41,72.2 44.22,73.01 | 44.22,73.01 M1.6 | 40.73,72.2 40.23,72.32 v40.2,72.2 | 40.73,72.2 40.23,72.08 v40.2,72.2 | 44.22,73.01 44.99,73.22 M1.6 | 44.22,73.01 44.43,73.78 M1.6
  Top 0.508: IC1.10 28.29,77.29 29.49,78.49 | v30,78.6 29.6,78.6 29.49,78.49 | 29.49,78.49 30.01,78.53 v30,78.6 | 29.49,78.49 29.98,78.67 v30,78.6
  Bottom 0.406: v30,78.6 30.37,78.23 | 30.37,78.23 36.4,72.2 39.67,72.2 | 39.67,72.2 v40.2,72.2 | M1.6 44.22,74.31 | 44.22,74.31 43.73,74.8 38.66,74.8 37.79,75.66 37.79,77.34 41.86,81.4 44.73,81.4 54.57,91.23 54.57,92.37 52.76,94.17 | 52.76,94.17 52.14,94.8 P_E1A.P$1 | 30.37,78.23 30.1,78.66 v30,78.6 | 30.37,78.23 29.94,78.5 v30,78.6 | 39.67,72.2 40.17,72.08 v40.2,72.2 | 39.67,72.2 40.17,72.32 v40.2,72.2 | 44.22,74.31 44.43,73.54 M1.6 | 44.22,74.31 44.99,74.1 M1.6 | 52.76,94.17 52.28,95.14 P_E1A.P$1 | 52.76,94.17 51.69,94.04 P_E1A.P$1
M1_CHB  (via drill 0.35)
  Top 0.508: IC1.11 28.09,78.09 28.34,78.34 | 28.34,78.34 28.6,78.6 v28.6,78.8 | 28.34,78.34 28.66,78.76 v28.6,78.8 | 28.34,78.34 28.53,78.83 v28.6,78.8
  Bottom 0.406: v28.6,78.8 28.97,79.17 | 28.97,79.17 29.2,79.4 31,79.4 33.8,76.6 | 41.42,73.66 36.74,73.66 34.6,75.8 | 41.42,73.66 M1.5 | 34.6,75.8 34.2,76.2 | 34.2,76.2 33.8,76.6 | 34.2,76.2 34.6,76.6 | 34.6,76.6 40.4,82.4 43.8,82.4 52.27,90.87 | 34.6,76.6 34.6,75.8 | 34.6,76.6 33.8,76.6 | 52.27,90.87 P_E1B.P$1 | 28.97,79.17 28.54,78.9 v28.6,78.8 | 28.97,79.17 28.7,78.74 v28.6,78.8 | 41.42,73.66 42.11,73.27 M1.5 | 41.42,73.66 42.11,74.05 M1.5 | 52.27,90.87 53.33,91.05 P_E1B.P$1 | 52.27,90.87 52.45,91.93 P_E1B.P$1
  pour Bottom: 34.6,76.6 33.8,76.6 34.6,75.8
M1_IN1
  Top 0.406: IC2.16 30.09,73.09 28.69,71.69 IC1.3
M1_IN2
  Top 0.406: IC2.15 29.74,73.74 28.49,72.49 IC1.4
M2+  (via drill 0.35)
  Top 0.406: IC2.7 37.1,77.01 38.08,77.01 | v38.6,77 38.59,77.01 38.08,77.01 | 38.08,77.01 38.57,76.88 v38.6,77 | 38.08,77.01 38.57,77.12 v38.6,77
  Bottom 0.813: v38.6,77 41.6,80 54.01,80 M2.2
M2-  (via drill 0.35)
  Top 0.406: IC2.5 38.09,75.69 38.2,75.8 38.27,75.8 | 38.27,75.8 v38.8,75.8 | 38.27,75.8 38.77,75.68 v38.8,75.8 | 38.27,75.8 38.77,75.92 v38.8,75.8
  Bottom 0.813: v38.8,75.8 40,75.8 41.66,77.46 51.45,77.46 M2.1
M2_CHA  (via drill 0.35)
  Top 0.508: IC1.1 28.16,70.09 | 28.16,70.09 28.31,70.09 v28.6,69.8 | v38,69.8 38.52,69.8 | 38.52,69.8 53.6,69.8 55.27,71.47 55.27,72.75 | 55.27,72.75 M2.6 | 28.16,70.09 28.55,69.75 v28.6,69.8 | 28.16,70.09 28.63,69.86 v28.6,69.8 | 38.52,69.8 38.01,69.87 v38,69.8 | 38.52,69.8 38.01,69.73 v38,69.8 | 55.27,72.75 55.63,73.48 M2.6 | 55.27,72.75 54.91,73.48 M2.6
  Bottom 0.406: 54.8,87.48 54.8,83 56.33,81.47 56.33,74.72 55.92,74.31 | 54.8,87.48 P_E2A.P$1 | M2.6 55.92,74.31 | 55.92,74.31 55.15,74.1 M2.6 | 55.92,74.31 55.71,73.54 M2.6 | 54.8,87.48 55.42,88.36 P_E2A.P$1 | 54.8,87.48 54.18,88.36 P_E2A.P$1
  Bottom 0.508: v28.6,69.8 29.12,69.8 | 29.12,69.8 37.48,69.8 | 37.48,69.8 v38,69.8 | 29.12,69.8 28.61,69.87 v28.6,69.8 | 29.12,69.8 28.61,69.73 v28.6,69.8 | 37.48,69.8 37.99,69.73 v38,69.8 | 37.48,69.8 37.99,69.87 v38,69.8
M2_CHB  (via drill 0.35)
  Top 0.508: IC1.2 28.98,70.89 | 28.98,70.89 29.09,70.89 v29.4,71.2 | 38.37,70.83 38.6,70.6 51,70.6 52.73,72.33 52.73,72.75 | 38.37,70.83 v38,71.2 | M2.5 52.73,72.75 | 28.98,70.89 29.43,71.14 v29.4,71.2 | 28.98,70.89 29.35,71.25 v29.4,71.2 | 38.37,70.83 38.06,71.24 v38,71.2 | 38.37,70.83 37.96,71.14 v38,71.2 | 52.73,72.75 53.09,73.48 M2.5 | 52.73,72.75 52.37,73.48 M2.5
  Bottom 0.406: M2.5 53.38,73.01 | 53.38,73.01 53.79,72.6 55.71,72.6 57.34,74.23 57.34,84.86 57.33,84.87 | 57.33,84.87 P_E2B.P$1 | 53.38,73.01 53.17,73.78 M2.5 | 53.38,73.01 52.61,73.22 M2.5 | 57.33,84.87 57.15,85.93 P_E2B.P$1 | 57.33,84.87 56.27,85.05 P_E2B.P$1
  Bottom 0.508: v29.4,71.2 29.93,71.2 | 29.93,71.2 37.48,71.2 | 37.48,71.2 v38,71.2 | 29.93,71.2 29.41,71.27 v29.4,71.2 | 29.93,71.2 29.41,71.13 v29.4,71.2 | 37.48,71.2 37.99,71.13 v38,71.2 | 37.48,71.2 37.99,71.27 v38,71.2
M2_IN1
  Top 0.406: IC2.9 29.64,77.64 28.49,76.49 IC1.9
M2_IN2
  Top 0.406: IC2.10 29.85,76.99 28.55,75.69 IC1.8
MCLR  (via drill 0.35)
  Top 0.508: IC1.18 20.45,78.65 20,78.2 17,78.2 16,79.2 15.93,79.2 | 15.93,79.2 v15.4,79.2 | HDR1.1 2.11,76.72 3.03,77.63 | v3.4,78 3.03,77.63 | v12,84 11.48,84 | 11.48,84 10.62,84 R3.2 | 15.93,79.2 15.41,79.27 v15.4,79.2 | 15.93,79.2 15.41,79.13 v15.4,79.2 | 3.03,77.63 3.44,77.94 v3.4,78 | 3.03,77.63 3.34,78.04 v3.4,78 | 11.48,84 11.99,83.93 v12,84 | 11.48,84 11.99,84.07 v12,84
  Bottom 0.508: v15.4,79.2 14.88,79.2 | 14.88,79.2 10,79.2 9.4,79.8 5.2,79.8 3.77,78.37 | v15.4,79.2 15.4,79.72 | 15.4,79.72 15.4,80.6 12.37,83.63 | 12.37,83.63 v12,84 | v3.4,78 3.77,78.37 | 14.88,79.2 15.39,79.13 v15.4,79.2 | 14.88,79.2 15.39,79.27 v15.4,79.2 | 15.4,79.72 15.33,79.21 v15.4,79.2 | 15.4,79.72 15.47,79.21 v15.4,79.2 | 3.77,78.37 3.36,78.06 v3.4,78 | 3.77,78.37 3.46,77.96 v3.4,78 | 12.37,83.63 12.06,84.04 v12,84 | 12.37,83.63 11.96,83.94 v12,84
  pour Bottom: 14.4,79.2 15.4,80.2 15.4,79.2
N$1
  Top 0.406: IC2.6 35.94,76.34 33.6,74 R12.1
N$2
  Top 0.406: D2.P$1 R7.1
N$3
  Top 0.406: IC2.11 31.22,76.36 32.36,76.36 32.4,76.4
  Top 0.61: C8.2 33.2,78.67 33.2,77.2 32.4,76.4
N$4
  Top 0.406: IC2.14 32.21,74.39 32.6,74 32.6,72.95 C9.1
N$5
  Top 0.406: IC2.3 35.99,74.39 35.4,73.8 35.4,73 36.2,72.2 R1.1
N$6
  Top 0.508: SW1.4 27.71,2.86 | 27.71,2.86 27.71,3.69 26.65,4.75 C12.1 | C12.1 24.7,5.05 R4.2 | C12.1 R5.1 | 27.71,2.86 27.26,2.16 SW1.4 | 27.71,2.86 28.17,2.16 SW1.4
N$7
  Top 0.508: SW_RST.4 7.06,78.31 6.88,78.5 | 6.88,78.5 6.6,78.77 6.6,85.15 R2.2 | 8.86,78.31 10.42,79.88 R3.1 | SW_RST.4 8.86,78.31 | 6.88,78.5 7.48,77.92 SW_RST.4 | 6.88,78.5 7.65,78.82 SW_RST.4 | 8.86,78.31 8.16,78.77 SW_RST.4 | 8.86,78.31 8.16,77.86 SW_RST.4
N$9
  Top 0.406: R6.1 D1.P$1
N$13
  Top 0.406: R8.1 D3.P$1
N$15
  Top 0.406: D4.P$1 R9.1
OSC1
  Top 0.508: IC1.30 13.51,72.49 12.37,73.63 11.76,73.63 | 11.76,73.63 Y1.1 | Y1.1 10.57,73.14 | 10.57,73.14 10.28,72.85 C7.1 | 11.76,73.63 11.53,73.96 Y1.1 | 11.76,73.63 11.53,73.3 Y1.1 | 10.57,73.14 10.96,73.07 Y1.1 | 10.57,73.14 10.5,73.53 Y1.1
OSC2
  Top 0.508: IC1.31 14.49,71.69 11.68,68.88 | Y1.2 11.35,68.55 11.68,68.88 | C6.1 7.5,68.55 10.36,68.55 | Y1.2 10.36,68.55 | 11.68,68.88 11.32,69.06 Y1.2 | 11.68,68.88 11.63,68.48 Y1.2 | 10.36,68.55 10.59,68.22 Y1.2 | 10.36,68.55 10.59,68.88 Y1.2
PGEC3  (via drill 0.35)
  Top 0.508: IC1.42 23.65,70.45 24.63,71.43 | 24.63,71.43 v25,71.8 | 24.63,71.43 25.04,71.74 v25,71.8 | 24.63,71.43 24.94,71.84 v25,71.8
  Bottom 0.508: v25,71.8 24.63,71.43 | 24.63,71.43 24.4,71.2 19.6,71.2 14.2,65.8 5.2,65.8 3.99,64.59 HDR1.5 | 24.63,71.43 25.04,71.74 v25,71.8 | 24.63,71.43 24.94,71.84 v25,71.8
PGED3  (via drill 0.35)
  Top 0.508: IC1.41 22.85,71.25 23.23,71.63 | 23.23,71.63 v23.6,72 | 23.23,71.63 23.64,71.94 v23.6,72 | 23.23,71.63 23.54,72.04 v23.6,72
  Bottom 0.508: v23.6,72 23.07,72 | 23.07,72 19.2,72 13.8,66.6 5,66.6 4.47,67.13 HDR1.4 | 23.07,72 23.59,71.93 v23.6,72 | 23.07,72 23.59,72.07 v23.6,72
S1_OUT
  Top 0.508: IC1.22 17.25,86.45 20,89.2 34.8,89.2 35.7,88.3 J1.3
S2_OUT
  Top 0.508: IC1.21 18.05,86.05 20.4,88.4 31.2,88.4 32,87.6 J3.1
S3_OUT
  Top 0.508: IC1.20 18.85,85.65 19.9,86.7 J2.3
SW1  (via drill 0.35)
  Top 0.508: IC1.36 18.85,66.45 18,65.6 16.73,65.6 | 16.73,65.6 v16.2,65.6 | v15.8,55.6 16.17,55.23 | 16.17,55.23 18,53.4 18,13.6 22.45,9.15 R5.2 | 16.73,65.6 16.21,65.67 v16.2,65.6 | 16.73,65.6 16.21,65.53 v16.2,65.6 | 16.17,55.23 15.86,55.64 v15.8,55.6 | 16.17,55.23 15.76,55.54 v15.8,55.6
  Bottom 0.508: v16.2,65.6 15.83,65.23 | 15.83,65.23 15.8,65.2 15.8,56.12 | 15.8,56.12 v15.8,55.6 | 15.83,65.23 16.24,65.54 v16.2,65.6 | 15.83,65.23 16.14,65.64 v16.2,65.6 | 15.8,56.12 15.73,55.61 v15.8,55.6 | 15.8,56.12 15.87,55.61 v15.8,55.6
UART_RX  (via drill 0.35)
  Top 0.254: IC1.37 19.65,69.85 19.83,70.03 | 19.83,70.03 v20.2,70.4 | v24,65.6 24.24,65.84 24.47,65.84 | HDR2.3 41.2,64.2 40.8,63.8 35.2,63.8 33.16,65.84 24.47,65.84 | 19.83,70.03 20.28,70.22 v20.2,70.4 | 19.83,70.03 20.02,70.48 v20.2,70.4 | 24.47,65.84 23.98,65.8 v24,65.6 | 24.47,65.84 24.15,65.47 v24,65.6
  Bottom 0.254: v24,65.6 23.63,65.97 | 23.63,65.97 20.2,69.4 20.2,69.88 | 20.2,69.88 v20.2,70.4 | 20.2,69.88 20.38,70.33 v20.2,70.4 | 20.2,69.88 20.02,70.33 v20.2,70.4 | 23.63,65.97 23.82,65.52 v24,65.6 | 23.63,65.97 24.08,65.78 v24,65.6
UART_TX
  Top 0.254: IC1.43 24.45,67.15 24.85,66.75 33.98,66.75 35.08,67.84 39.08,67.84 39.32,67.6 40.52,67.6 40.76,67.84 42.76,67.84 43.73,66.87 HDR2.4
VCAP/VDDCORE  (via drill 0.35)
  Top 0.508: IC1.7 25.62,74.89 | 25.62,74.89 25.51,74.89 v25.2,75.2 | 25.62,74.89 25.25,75.25 v25.2,75.2 | 25.62,74.89 25.17,75.14 v25.2,75.2
  Bottom 0.508: v25.2,75.2 24.83,74.83 | 24.83,74.83 23.92,73.92 C1.1 | 24.83,74.83 25.24,75.14 v25.2,75.2 | 24.83,74.83 25.14,75.24 v25.2,75.2

### Text on the board
tPlace: RSENSE | - | +
bPlace: MCLR | 3V3 | GND | PGED | PGEC | NC | - | + | MICROMOUSE WISE20/21 | Philipp Hagenlocher / Matteo Nardini / Hendrik Möller / Congnan Wang
tNames: RST | MCLR | 3V3 | PRGRM | GND | MOD | CTS | RX | TX | 3V3 | RTS | GND | DFU | PGED | PGEC | BT_UART | NC
bNames: MOD | CTS | RX | TX | 3V3 | RTS | GND | DFU